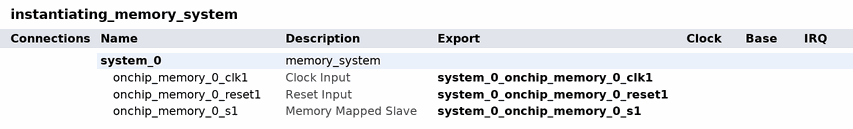
[diagram p0: system contents]
# Platform Designer (Qsys) system instantiating_memory_system, MAX V 5M1270ZT144C5
# Parameters at their usual value, and those the tool derives, are not listed.
package require qsys
create_system instantiating_memory_system
set_project_property DEVICE_FAMILY {MAX V}
set_project_property DEVICE 5M1270ZT144C5

add_instance system_0 memory_system 1.0
set_instance_parameter_value system_0 component_data_width 16
set_instance_parameter_value system_0 component_memory_size 131072

# exported interfaces
add_interface system_0_onchip_memory_0_clk1 clock sink
set_interface_property system_0_onchip_memory_0_clk1 EXPORT_OF system_0.onchip_memory_0_clk1
add_interface system_0_onchip_memory_0_reset1 reset sink
set_interface_property system_0_onchip_memory_0_reset1 EXPORT_OF system_0.onchip_memory_0_reset1
add_interface system_0_onchip_memory_0_s1 avalon slave
set_interface_property system_0_onchip_memory_0_s1 EXPORT_OF system_0.onchip_memory_0_s1

set_interconnect_requirement {$system} qsys_mm.clockCrossingAdapter HANDSHAKE
set_interconnect_requirement {$system} qsys_mm.enableEccProtection FALSE
set_interconnect_requirement {$system} qsys_mm.insertDefaultSlave FALSE
set_interconnect_requirement {$system} qsys_mm.maxAdditionalLatency 1

save_system instantiating_memory_system.qsys
